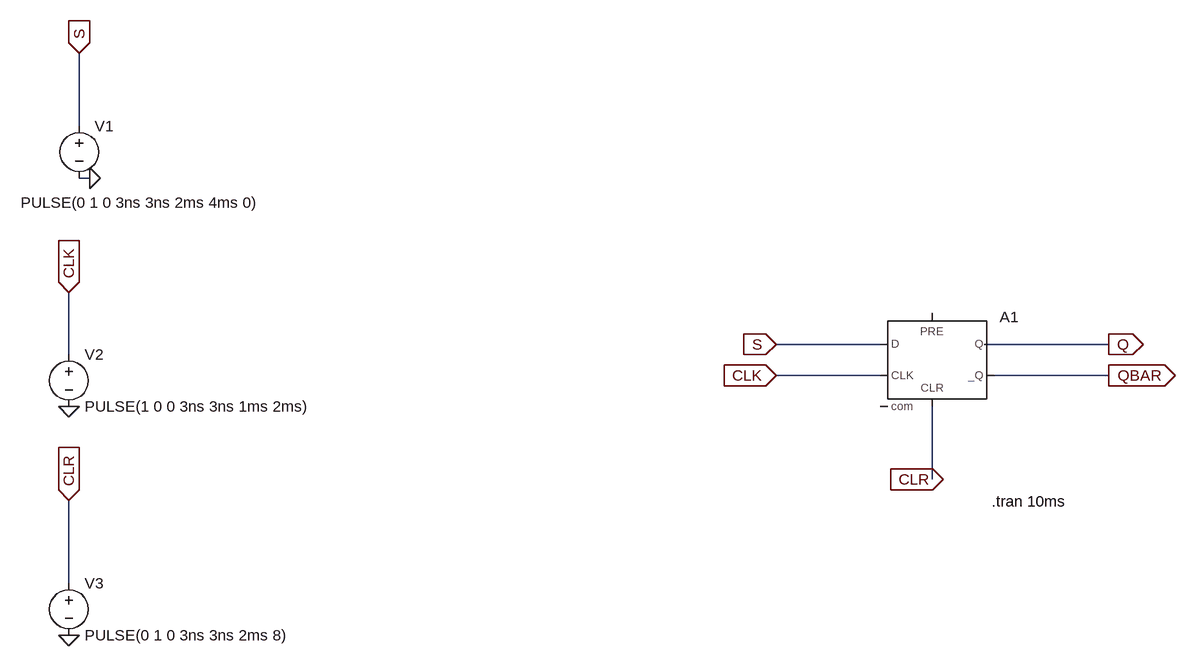
[diagram p0: schematic Draft2.asc]
Draft2.asc, the LTspice schematic file:
Version 4
SHEET 1 1276 680
WIRE -432 -288 -432 -400
WIRE -416 -208 -432 -208
WIRE 800 48 640 48
WIRE 1152 48 960 48
WIRE -448 64 -448 -32
WIRE 800 96 640 96
WIRE 1152 96 976 96
WIRE 880 256 880 144
WIRE -448 416 -448 288
FLAG -448 496 0
FLAG -416 -208 0
FLAG -432 -400 S
IOPIN -432 -400 In
FLAG 640 48 S
IOPIN 640 48 In
FLAG -448 -32 CLK
IOPIN -448 -32 In
FLAG 640 96 CLK
IOPIN 640 96 In
FLAG -448 288 CLR
IOPIN -448 288 In
FLAG 1152 48 Q
IOPIN 1152 48 Out
FLAG 1152 96 QBAR
IOPIN 1152 96 Out
FLAG -448 144 0
FLAG 816 256 CLR
IOPIN 816 256 Out
SYMBOL Digital\\dflop 880 0 R0
SYMATTR InstName A1
SYMBOL voltage -432 -304 R0
WINDOW 3 -90 134 Left 2
WINDOW 123 0 0 Left 0
WINDOW 39 0 0 Left 0
SYMATTR InstName V1
SYMATTR Value PULSE(0 1 0 3ns 3ns 2ms 4ms 0)
SYMBOL voltage -448 400 R0
WINDOW 123 0 0 Left 0
WINDOW 39 0 0 Left 0
SYMATTR InstName V3
SYMATTR Value PULSE(0 1 0 3ns 3ns 2ms 8)
SYMBOL voltage -448 48 R0
WINDOW 123 0 0 Left 0
WINDOW 39 0 0 Left 0
SYMATTR InstName V2
SYMATTR Value PULSE(1 0 0 3ns 3ns 1ms 2ms)
TEXT 972 290 Left 2 !.tran 10ms

The netlist it stands for:
* Draft2.asc
A1 S 0 CLK 0 N001 QBAR Q 0 DFLOP
V1 S 0 PULSE(0 1 0 3ns 3ns 2ms 4ms 0)
V3 CLR 0 PULSE(0 1 0 3ns 3ns 2ms 8)
V2 CLK 0 PULSE(1 0 0 3ns 3ns 1ms 2ms)
.tran 10ms
.backanno
.end

* Results of the author's LTspice run, read from the files saved beside the schematic
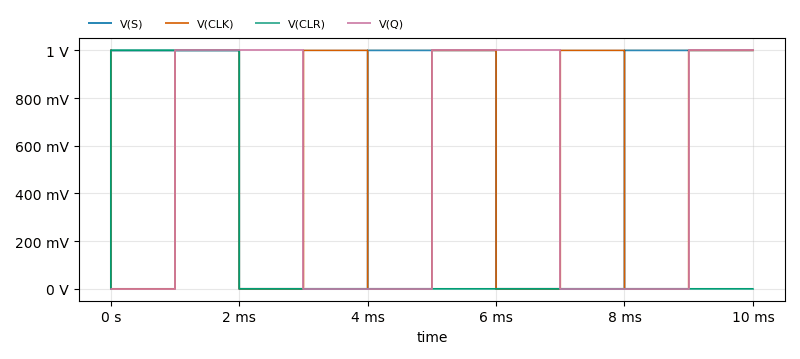
[diagram p1: Transient Analysis of Draft2.asc, plotted from the saved traces]
* Transient Analysis, 1 run:
*   V(S): min 0 V, max 1 V, average 600 mV, rms 774.6 mV, last 1 V
*   V(CLK): min 0 V, max 1 V, average 500 mV, rms 707.1 mV, last 1 V
*   V(CLR): min 0 V, max 1 V, average 200 mV, rms 447.2 mV, last 0 V
*   V(Q): min 0 V, max 1 V, average 500 mV, rms 707.1 mV, last 1 V